# EAGLE schematic all_proen2 (EAGLE 9.4.2)
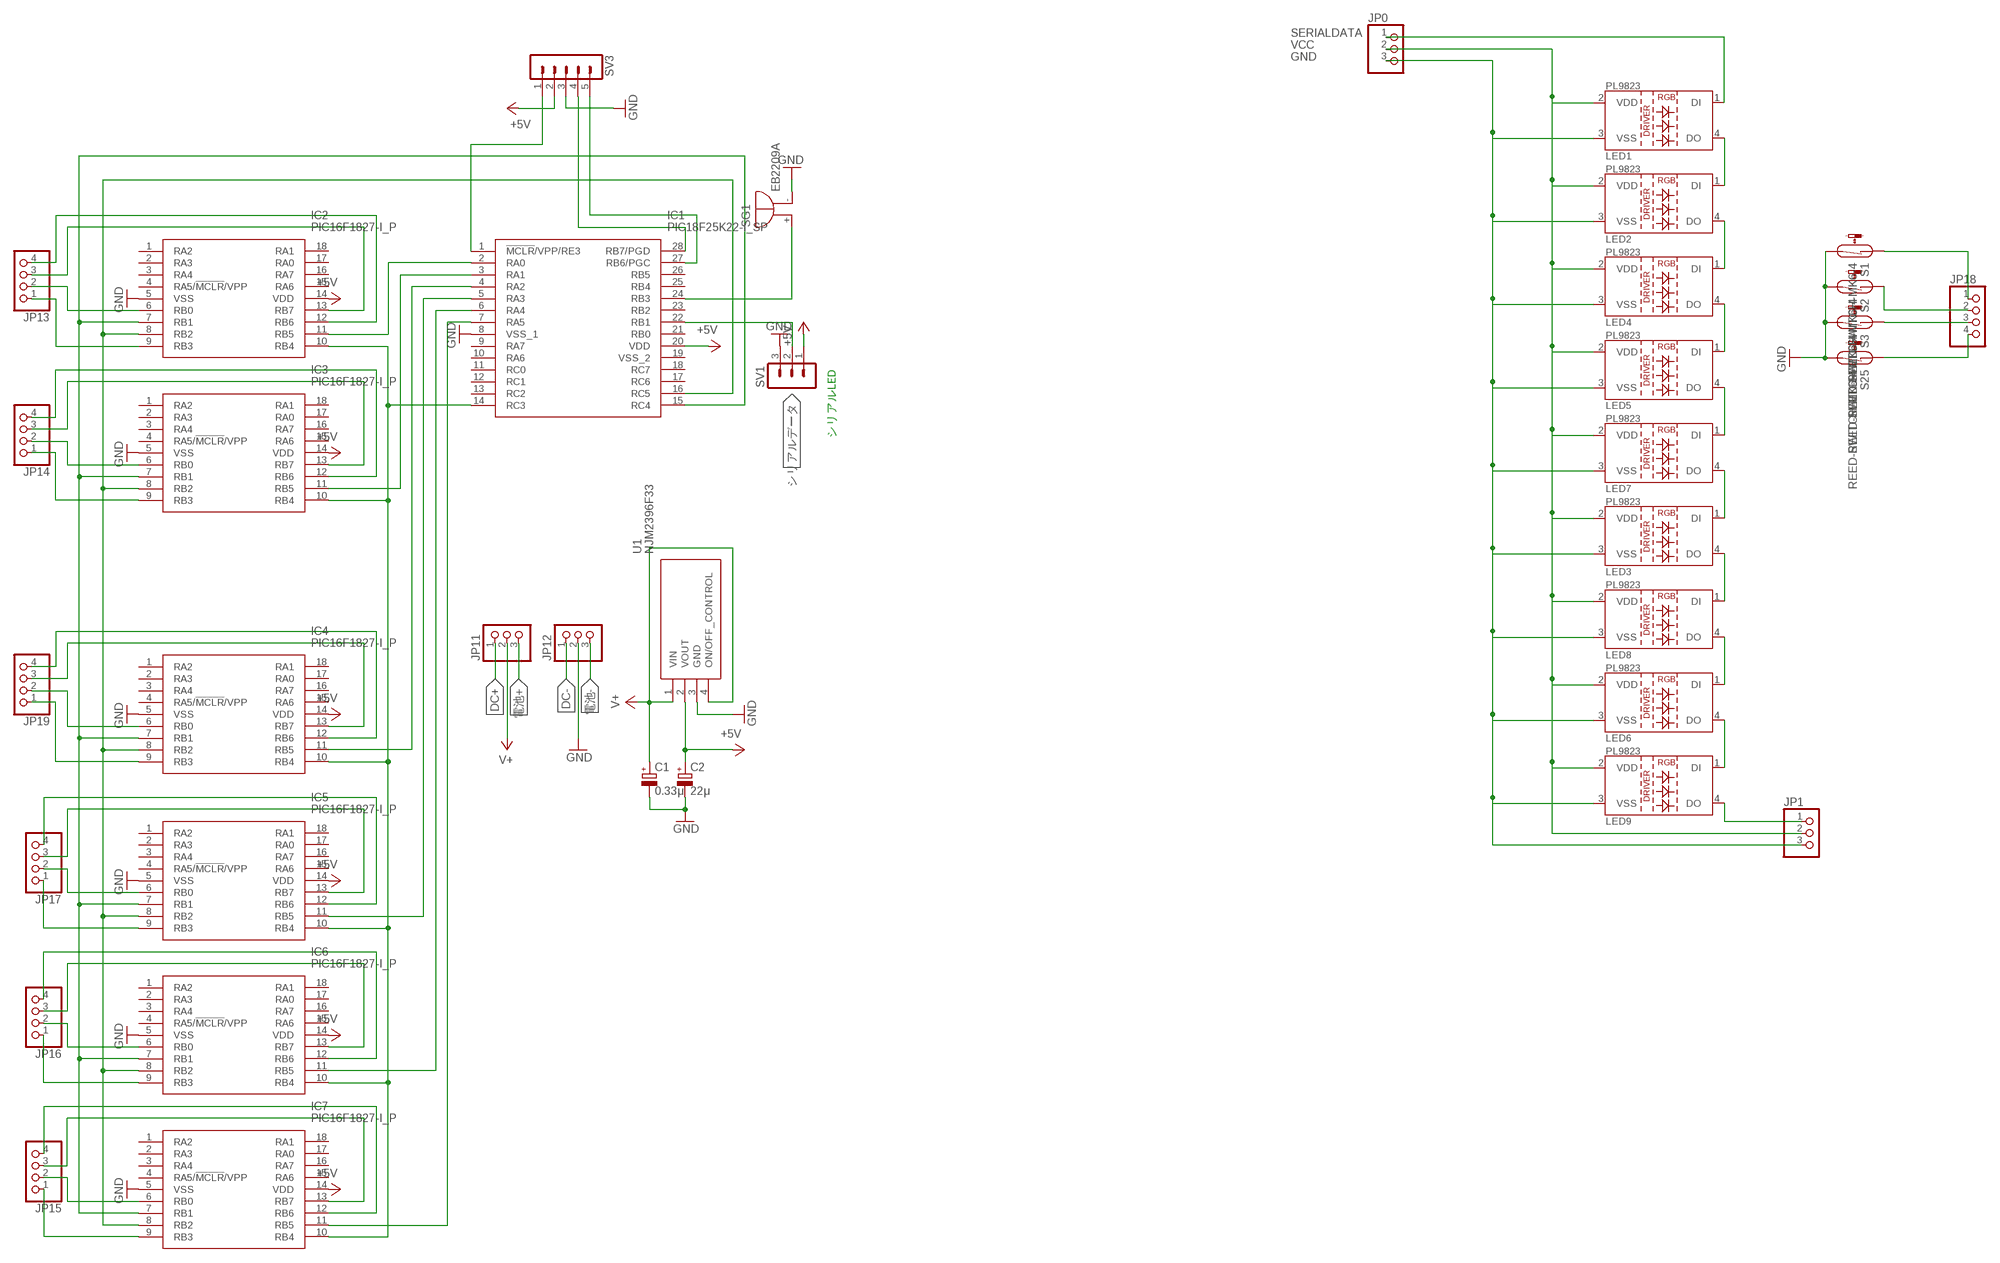
[diagram p0: schematic, sheet 1]

## Parts
C1  0.33μ  CPOL-EUE2,5-6E  [E2,5-6E]
C2  22μ  CPOL-EUE2,5-6E  [E2,5-6E]
IC1  PIC18F25K22-I_SP  [DIP794W56P254L3486H508Q28N]
IC2  PIC16F1827-I_P  [DIP794W56P254L2286H533Q18N]
IC3  PIC16F1827-I_P  [DIP794W56P254L2286H533Q18N]
IC4  PIC16F1827-I_P  [DIP794W56P254L2286H533Q18N]
IC5  PIC16F1827-I_P  [DIP794W56P254L2286H533Q18N]
IC6  PIC16F1827-I_P  [DIP794W56P254L2286H533Q18N]
IC7  PIC16F1827-I_P  [DIP794W56P254L2286H533Q18N]
JP0  PINHD-1X3  [1X03]
JP1  PINHD-1X3  [1X03]
JP11  PINHD-1X3  [1X03]
JP12  PINHD-1X3  [1X03]
JP13  PINHD-1X4  [1X04]
JP14  PINHD-1X4  [1X04]
JP15  PINHD-1X4  [1X04]
JP16  PINHD-1X4  [1X04]
JP17  PINHD-1X4  [1X04]
JP18  PINHD-1X4  [1X04]
JP19  PINHD-1X4  [1X04]
LED1  LED-PL9823-F5  [LED-PL9823-F5]
LED2  LED-PL9823-F5  [LED-PL9823-F5]
LED3  LED-PL9823-F5  [LED-PL9823-F5]
LED4  LED-PL9823-F5  [LED-PL9823-F5]
LED5  LED-PL9823-F5  [LED-PL9823-F5]
LED6  LED-PL9823-F5  [LED-PL9823-F5]
LED7  LED-PL9823-F5  [LED-PL9823-F5]
LED8  LED-PL9823-F5  [LED-PL9823-F5]
LED9  LED-PL9823-F5  [LED-PL9823-F5]
S1  REED-SWITCH-MK6-4  [MK6-4]
S2  REED-SWITCH-MK6-4  [MK6-4]
S3  REED-SWITCH-MK6-4  [MK6-4]
S25  REED-SWITCH-MK6-4  [MK6-4]
SG1  EB2209A  [EB2209A]
SV1  MA03-1  [MA03-1]
SV3  MA05-1  [MA05-1]
U1  NJM2396F33  [TO254P480X1000X1900-4P]

## Nets
+5V: C2.+ IC1.20(VDD) IC2.14(VDD) IC3.14(VDD) IC4.14(VDD) IC5.14(VDD) IC6.14(VDD) IC7.14(VDD) SV1.1 SV3.2 U1.2(VOUT)
DC+: JP11.1
DC-: JP12.1
GND: C1.- C2.- IC1.8(VSS_1) IC2.5(VSS) IC3.5(VSS) IC4.5(VSS) IC5.5(VSS) IC6.5(VSS) IC7.5(VSS) JP0.3 JP1.3 JP12.2 LED1.3(VSS) LED2.3(VSS) LED3.3(VSS) LED4.3(VSS) LED5.3(VSS) LED6.3(VSS) LED7.3(VSS) LED8.3(VSS) LED9.3(VSS) S1.2 S2.2 S3.2 S25.2 SG1.- SV1.3 SV3.3 U1.3(GND)
N$1: IC2.12(RB6) JP13.4
N$2: IC2.13(RB7) JP13.3
N$3: IC2.6(RB0) JP13.2
N$4: IC2.9(RB3) JP13.1
N$5: IC1.15(RC4) IC2.7(RB1) IC3.7(RB1) IC4.7(RB1) IC5.7(RB1) IC6.7(RB1) IC7.7(RB1)
N$6: IC1.16(RC5) IC2.8(RB2) IC3.8(RB2) IC4.8(RB2) IC5.8(RB2) IC6.8(RB2) IC7.8(RB2)
N$7: IC1.2(RA0) IC2.11(RB5)
N$8: IC1.3(RA1) IC3.11(RB5)
N$9: IC3.12(RB6) JP14.4
N$10: IC3.13(RB7) JP14.3
N$11: IC3.6(RB0) JP14.2
N$12: IC3.9(RB3) JP14.1
N$13: IC1.4(RA2) IC4.11(RB5)
N$14: IC1.5(RA3) IC5.11(RB5)
N$15: IC1.6(RA4) IC6.11(RB5)
N$16: IC1.14(RC3) IC2.10(RB4) IC3.10(RB4) IC4.10(RB4) IC5.10(RB4) IC6.10(RB4) IC7.10(RB4)
N$17: IC4.12(RB6) JP19.4
N$18: IC4.13(RB7) JP19.3
N$19: IC4.6(RB0) JP19.2
N$20: IC4.9(RB3) JP19.1
N$21: IC1.7(RA5) IC7.11(RB5)
N$22: JP18.1 S1.1
N$23: IC5.9(RB3) JP17.1
N$24: IC1.24(RB3) SG1.+
N$25: IC5.12(RB6) JP17.4
N$26: IC5.13(RB7) JP17.3
N$27: IC5.6(RB0) JP17.2
N$28: IC6.9(RB3) JP16.1
N$29: JP18.4 S25.1
N$30: IC1.1(!MCLR!/VPP/RE3) SV3.1
N$31: IC1.28(RB7/PGD) SV3.4
N$32: IC1.27(RB6/PGC) SV3.5
N$33: IC6.12(RB6) JP16.4
N$34: IC6.13(RB7) JP16.3
N$35: IC6.6(RB0) JP16.2
N$36: IC7.9(RB3) JP15.1
N$37: LED1.4(DO) LED2.1(DI)
N$38: LED2.4(DO) LED4.1(DI)
N$39: LED4.4(DO) LED5.1(DI)
N$40: LED5.4(DO) LED7.1(DI)
N$41: IC7.12(RB6) JP15.4
N$42: IC7.13(RB7) JP15.3
N$43: IC7.6(RB0) JP15.2
N$44: LED3.1(DI) LED7.4(DO)
N$45: LED3.4(DO) LED8.1(DI)
N$46: LED6.1(DI) LED8.4(DO)
N$47: LED6.4(DO) LED9.1(DI)
N$48: JP1.1 LED9.4(DO)
N$92: JP18.3 S3.1
N$93: JP18.2 S2.1
SERIALDATA: JP0.1 LED1.1(DI)
V+: C1.+ JP11.2 U1.1(VIN) U1.4(ON/OFF_CONTROL)
VCC: JP0.2 JP1.2 LED1.2(VDD) LED2.2(VDD) LED3.2(VDD) LED4.2(VDD) LED5.2(VDD) LED6.2(VDD) LED7.2(VDD) LED8.2(VDD) LED9.2(VDD)
シリアルデータ: IC1.22(RB1) SV1.2
電池+: JP11.3
電池-: JP12.3
Unconnected: IC1.9(RA7) IC1.10(RA6) IC1.11(RC0) IC1.12(RC1) IC1.13(RC2) IC1.17(RC6) IC1.18(RC7) IC1.19(VSS_2) IC1.21(RB0) IC1.23(RB2) IC1.25(RB4) IC1.26(RB5) IC2.1(RA2) IC2.2(RA3) IC2.3(RA4) IC2.4(RA5/!MCLR!/VPP) IC2.15(RA6) IC2.16(RA7) IC2.17(RA0) IC2.18(RA1) IC3.1(RA2) IC3.2(RA3) IC3.3(RA4) IC3.4(RA5/!MCLR!/VPP) IC3.15(RA6) IC3.16(RA7) IC3.17(RA0) IC3.18(RA1) IC4.1(RA2) IC4.2(RA3) IC4.3(RA4) IC4.4(RA5/!MCLR!/VPP) IC4.15(RA6) IC4.16(RA7) IC4.17(RA0) IC4.18(RA1) IC5.1(RA2) IC5.2(RA3) IC5.3(RA4) IC5.4(RA5/!MCLR!/VPP) IC5.15(RA6) IC5.16(RA7) IC5.17(RA0) IC5.18(RA1) IC6.1(RA2) IC6.2(RA3) IC6.3(RA4) IC6.4(RA5/!MCLR!/VPP) IC6.15(RA6) IC6.16(RA7) IC6.17(RA0) IC6.18(RA1) IC7.1(RA2) IC7.2(RA3) IC7.3(RA4) IC7.4(RA5/!MCLR!/VPP) IC7.15(RA6) IC7.16(RA7) IC7.17(RA0) IC7.18(RA1)

## Notes on the sheet
- シリアルLED

## Library data of the parts
C1 C2 = rcl:CPOL-EU: POLARIZED CAPACITOR, European symbol; SPICEPREFIX: C
IC1 = PIC18F25K22-I_SP:PIC18F25K22-I_SP: MCU 8-Bit PIC18 32KB Flash XLP SPDIP28 Microchip PIC18F25K22-I/SP, 8bit PIC Microcontroller, 64MHz, 32 kB Flash, 28-Pin PDIP Source: Datasheet <http://ww1.microchip.com/downloads/en/DeviceDoc/40001412G.pdf>; ALLIED_NUMBER: 70048033; ALLIED_PRICE-STOCK: https://www.alliedelec.com/microchip-technology-inc-pic18f25k22-i-sp/70048033/; DESCRIPTION: MCU 8-Bit PIC18 32KB Flash XLP SPDIP28 Microchip PIC18F25K22-I/SP, 8bit PIC Microcontroller, 64MHz, 32 kB Flash, 28-Pin PDIP; HEIGHT: 5.08mm; MANUFACTURER_NAME: Microchip; MANUFACTURER_PART_NUMBER: PIC18F25K22-I/SP; MOUSER_PART_NUMBER: 579-PIC18F25K22ISP; MOUSER_PRICE-STOCK: https://www.mouser.com/Search/Refine.aspx?Keyword=579-PIC18F25K22ISP; RS_PART_NUMBER: 8231142; RS_PRICE-STOCK: https://uk.rs-online.com/web/p/products/8231142
IC2-IC7 = PIC16F1827-I_P:PIC16F1827-I_P: MCU 7 KB Flash with 32 MHz Osc, 16 I/0 Microchip PIC16F1827-I/P, 8bit PIC Microcontroller, 32MHz, 4K x 14 words, 256 B Flash, 18-Pin PDIP Source: Datasheet <http://ww1.microchip.com/downloads/en/DeviceDoc/41391D.pdf>; ALLIED_NUMBER: 70047956; ALLIED_PRICE-STOCK: https://www.alliedelec.com/microchip-technology-inc-pic16f1827-i-p/70047956/; DESCRIPTION: MCU 7 KB Flash with 32 MHz Osc, 16 I/0 Microchip PIC16F1827-I/P, 8bit PIC Microcontroller, 32MHz, 4K x 14 words, 256 B Flash, 18-Pin PDIP; HEIGHT: 5.334mm; MANUFACTURER_NAME: Microchip; MANUFACTURER_PART_NUMBER: PIC16F1827-I/P; MOUSER_PART_NUMBER: 579-PIC16F1827-I/P; MOUSER_PRICE-STOCK: https://www.mouser.com/Search/Refine.aspx?Keyword=579-PIC16F1827-I%2FP; RS_PART_NUMBER: 6988959P; RS_PRICE-STOCK: http://uk.rs-online.com/web/p/products/6988959P
JP0 JP1 JP11 JP12 = pinhead:PINHD-1X3: PIN HEADER
JP13-JP19 = pinhead:PINHD-1X4: PIN HEADER
LED1-LED9 = Ai_LED:LED-PL9823
S1-S3 S25 = switch-reed:REED-SWITCH-: Reed Sensor; OC_FARNELL: unknown
SG1 = buzzer:EB2209A: BUZZER Source: Buerklin; OC_FARNELL: unknown; OC_NEWARK: unknown
SV1 = con-lstb:MA03-1: PIN HEADER; OC_FARNELL: unknown; OC_NEWARK: unknown
SV3 = con-lstb:MA05-1: PIN HEADER; OC_FARNELL: unknown; OC_NEWARK: unknown
U1 = NJM2396F33:NJM2396F33: LOW DROPOUT VOLTAGE REGULATOR WITH ON/OFF CONTROL Source: Datasheet <http://www.njr.com/semicon/PDF/NJM2396_E.pdf>; DESCRIPTION: LOW DROPOUT VOLTAGE REGULATOR WITH ON/OFF CONTROL; HEIGHT: 4.8mm; MANUFACTURER_NAME: New Japan Radio; MANUFACTURER_PART_NUMBER: NJM2396F33; RS_PART_NUMBER: 6641023; RS_PRICE-STOCK: https://uk.rs-online.com/web/p/products/6641023